# Altium project PCB_board.PrjPcb
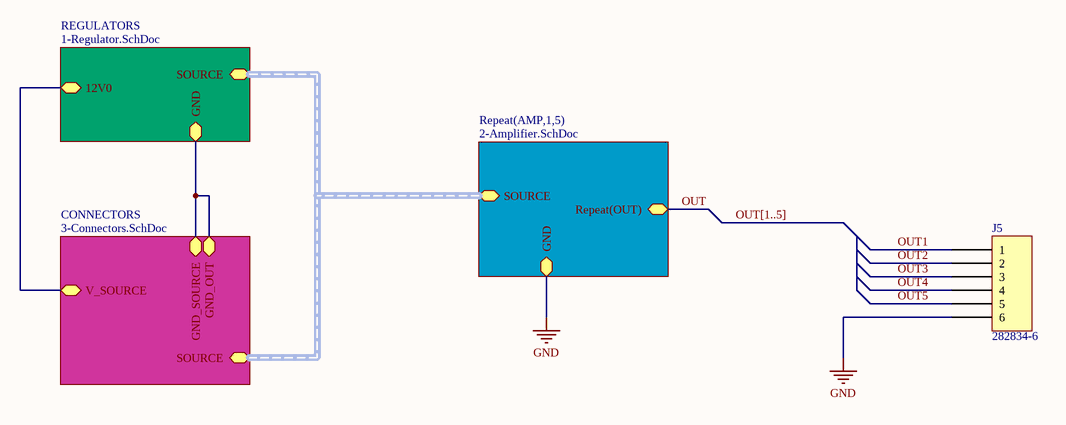
[diagram p0: 0-Hierarchy.SchDoc]
4 sheets, 54 parts. Net scope: hierarchical (ports join the sheet entries above them; power ports are global).
Board file: PCB_Class.PcbDoc
Sheets:
  0-Hierarchy.SchDoc
    REGULATORS = 1-Regulator.SchDoc
    CONNECTORS = 3-Connectors.SchDoc
    AMP1 = 2-Amplifier.SchDoc
    AMP2 = 2-Amplifier.SchDoc
    AMP3 = 2-Amplifier.SchDoc
    AMP4 = 2-Amplifier.SchDoc
    AMP5 = 2-Amplifier.SchDoc

## Sheet 0-Hierarchy.SchDoc
size A4; Author: Fabian Castaño; CompanyName: GIBIC Tech-Hub; Engineer: Fabian Castaño; Organization: Universidad de Antioquia; Address1: UdeA; Address2: Medellín; Address3: Antioquia; Address4: Colombia 050010; DocumentNumber: 1; SheetNumber: 1; SheetTotal: 4

### Parts
J5  282834-6  [TE 282834-6]

### Sub-sheets
CONNECTORS = 3-Connectors.SchDoc: V_SOURCE, GND_SOURCE, GND_OUT, SOURCE (harness SUP_HAR)
REGULATORS = 1-Regulator.SchDoc: 12V0, GND, SOURCE (harness SUP_HAR)
Repeat(AMP,1,5) = 2-Amplifier.SchDoc: SOURCE (harness SUP_HAR), Repeat(OUT), GND

### Nets
12V: sheet REGULATORS/12V0, sheet CONNECTORS/V_SOURCE
GND: J5.6 ; sheet REGULATORS/GND, sheet CONNECTORS/GND_SOURCE, sheet CONNECTORS/GND_OUT, sheet Repeat(AMP,1,5)/GND
OUT: sheet Repeat(AMP,1,5)/Repeat(OUT)
OUT1: J5.1
OUT2: J5.2
OUT3: J5.3
OUT4: J5.4
OUT5: J5.5

### Buses and harness runs
bus OUT[1..5]
harness sheet CONNECTORS/SOURCE = sheet REGULATORS/SOURCE = sheet Repeat(AMP,1,5)/SOURCE

### Notes on the sheet
- Notes
- Title
- Size:
- Date:
- A4
- Number:
- Time:
- Revision:
- Sheet
- of
- File:

### Library data of the parts
J5 = 282834-6: TERM BLK 6P SIDE ENT 2.54MM PCB; Manufacturer: TE Connectivity AMP Connectors; Current: 10A; Mating Orientation: Horizontal with Board; Number of Levels: 1; Pitch: 0.100" (2.54mm); Positions Per Level: 6; Voltage: 150V; Wire Gauge: 16-30 AWG; Wire Termination: Screw - Rising Cage Clamp; Part Number: 282834-6; Color: Green; ComponentLink1Description: Datasheet; ComponentLink1URL: https://www.te.com/commerce/DocumentDelivery/DDEController?Action=srchrtrv&DocNm=282834&DocType=Customer+Drawing&DocLang=English; ComponentLink2Description: DigiKey Link; ComponentLink2URL: http://digikey.com/product-detail/en/te-connectivity-amp-connectors/282834-6/A98337-ND/1153267; LastUpdated: 15/01/2020 04:16:31; Lifecycle Status: Active; Minimum Order: 1; Mounting Type: Through Hole; Packaging: Bulk; Part Status: Active; Price: 4.72; Series: Buchanan; Supplier 1: DigiKey; Supplier Part Number 1: A98337-ND

## Sheet 1-Regulator.SchDoc
size A4; Author: Fabian Castaño; CompanyName: GIBIC Tech-Hub; Engineer: Fabian Castaño; Organization: Universidad de Antioquia; Address1: UdeA; Address2: Medellín; Address3: Antioquia; Address4: Colombia 050010; DocumentNumber: 2; SheetNumber: 2; SheetTotal: 4
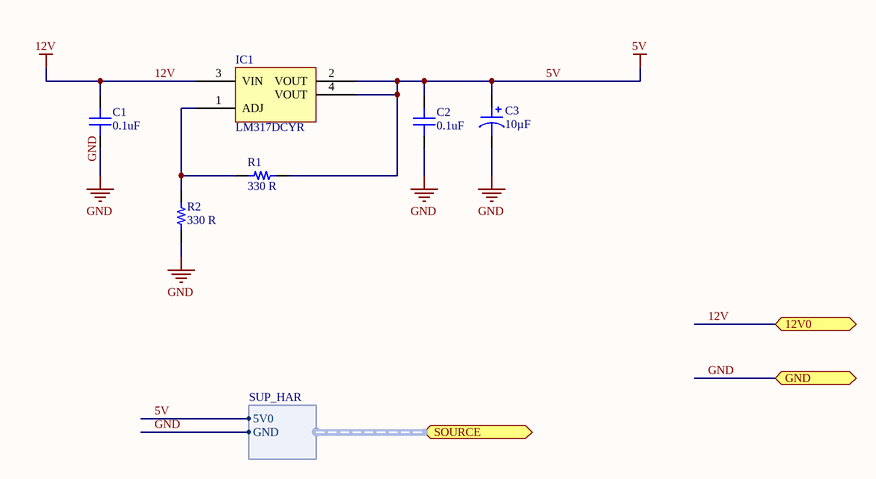
[diagram p1: 1-Regulator.SchDoc]

### Parts
C1  0.1uF  [CAP 0805_2012]
C2  0.1uF  [CAP 0805_2012]
C3  10µF  [CAP POL 1206_3216]
IC1  LM317DCYR  [TI SOT-223 DCY]
R1  330 R  [RES 0805_2012]
R2  330 R  [RES 0805_2012]

### Ports
12V0, GND, SOURCE (harness SUP_HAR)

### Harnesses
SUP_HAR: 5V0, GND

### Nets
5V: C2.2 C3.1 IC1.2(VOUT) IC1.4(VOUT) R1.2 ; port SOURCE.5V0
12V: C1.2 IC1.3(VIN) ; port 12V0
GND: C1.1 C2.1 C3.2 R2.1 ; port GND, port SOURCE.GND
NetIC1_1: IC1.1(ADJ) R1.1 R2.2

### Notes on the sheet
- Notes
- Title
- Size:
- Date:
- A4
- Number:
- Time:
- Revision:
- Sheet
- of
- File:

### Library data of the parts
C1 C2 = CBR08C569BCGAC: CAP CER 5.6PF 500V C0G/NP0 0805; Manufacturer: KEMET; Temperature Coefficient: C0G, NP0; Tolerance: ±0.1pF; Part Number: CBR08C569BCGAC; Value: 0.1uF; Applications: RF, Microwave, High Frequency; Capacitance: 5.6pF; ComponentLink1Description: Datasheet; ComponentLink1URL: https://api.kemet.com/component-edge/download/datasheet/CBR08C569BCGAC.pdf; ComponentLink2Description: DigiKey Link; ComponentLink2URL: http://digikey.com/product-detail/en/kemet/CBR08C569BCGAC/399-11260-1-ND/4376887; Device Package: 0805 (2012 Metric); Features: High Q, Low Loss, Ultra Low ESR; LastUpdated: 2/09/2020 01:04:42; Lifecycle Status: Active; Minimum Order: 1; Mounting Type: Surface Mount, MLCC; Operating Temperature: -55°C ~ 125°C; Package / Case: 0805 (2012 Metric); Packaging: TapeAndReel; PartId: 2427; Part Status: Active; Price: 0.48; Series: CBR-SMD RF C0G; Size / Dimension: 0.079" L x 0.049" W (2.00mm x 1.25mm); Supplier 1: DigiKey; Supplier Part Number 1: 399-11260-1-ND; Thickness (Max): 0.037" (0.95mm); Voltage - Rated: 500V
C3 = TR3A336K6R3C0600: CAP TANT 33UF 10% 6.3V 1206; Manufacturer: Vishay Sprague; Manufacturer Size Code: A; Capacitance: 33µF; ESR (Equivalent Series Resistance): 600mOhm; Type: Molded; Part Number: TR3A336K6R3C0600; Value: 10µF; ComponentLink1Description: Datasheet; ComponentLink1URL: http://www.vishay.com/docs/40080/tr3.pdf; ComponentLink2Description: DigiKey Link; ComponentLink2URL: http://digikey.com/product-detail/en/vishay-sprague/TR3A336K6R3C0600/718-1305-1-ND/1663027; Device Package: 1206 (3216 Metric); Features: General Purpose; Height - Seated (Max): 0.071" (1.80mm); LastUpdated: 2/09/2020 01:15:58; Lifecycle Status: Active; Minimum Order: 1; Mounting Type: Surface Mount; Operating Temperature: -55°C ~ 125°C; Package / Case: 1206 (3216 Metric); Packaging: TapeAndReel; PartId: 297; Part Status: Active; Price: 0.24; Series: TANTAMOUNT®, TR3; Size / Dimension: 0.126" L x 0.063" W (3.20mm x 1.60mm); Supplier 1: DigiKey; Supplier Part Number 1: 718-1305-1-ND; Tolerance: ±10%; Voltage - Rated: 6.3V
IC1 = LM317DCYR: IC REG LIN POS ADJ 1.5A SOT223-4; Manufacturer: Texas Instruments; Number of Regulators: 1; Output Configuration: Positive; Output Type: Adjustable; Protection Features: Over Temperature, Short Circuit; PSRR: 64dB ~ 57dB (120Hz); Voltage - Input (Max): 40V; Voltage - Output (Max): 37V; Voltage - Output (Min/Fixed): 1.25V; Part Number: LM317DCYR; ComponentLink1Description: Datasheet; ComponentLink1URL: http://www.ti.com/general/docs/suppproductinfo.tsp?distId=10&gotoUrl=http%3A%2F%2Fwww.ti.com%2Flit%2Fgpn%2Flm317; ComponentLink2Description: DigiKey Link; ComponentLink2URL: //digikey.com/product-detail/en/texas-instruments/LM317DCYR/296-12602-2-ND/443739; Current - Output: 1.5A; Device Package: TO-261-4, TO-261AA; LastUpdated: 9/12/2019 14:53:08; Lifecycle Status: 0; Minimum Order: 1; Mounting Type: Surface Mount; Operating Temperature: 0°C ~ 125°C; Package / Case: TO-261-4, TO-261AA; Packaging: TapeAndReel; Part Status: Active; Price: 0.28; Series: -; Supplier 1: DigiKey; Supplier Part Number 1: 296-12602-2-ND; Supplier Device Package: SOT-223-4
R1 R2 = RNCF0805DTE82K0: RES 82K OHM 0.5% 1/8W 0805; Manufacturer: Stackpole Electronics Inc; Power (Watts): 0.125W, 1/8W; Resistance: 82 kOhms; Temperature Coefficient: ±25ppm/°C; Part Number: RNCF0805DTE82K0; Value: 330 R; ComponentLink1Description: Datasheet; ComponentLink1URL: https://www.seielect.com/catalog/sei-rncf.pdf; ComponentLink2Description: DigiKey Link; ComponentLink2URL: http://digikey.com/product-detail/en/stackpole-electronics-inc/RNCF0805DTE82K0/RNCF0805DTE82K0CT-ND/9915472; Composition: Thin Film; Device Package: 0805 (2012 Metric); Features: Automotive AEC-Q200; Height - Seated (Max): 0.026" (0.65mm); LastUpdated: 2/09/2020 01:15:08; Lifecycle Status: Active; Minimum Order: 1; Number of Terminations: 2; Operating Temperature: -55°C ~ 155°C; Package / Case: 0805 (2012 Metric); Packaging: TapeAndReel; PartId: 35165; Part Status: Active; Price: 0.02; Ratings: AEC-Q200; Series: RNCF; Size / Dimension: 0.079" L x 0.049" W (2.00mm x 1.25mm); Supplier 1: DigiKey; Supplier Part Number 1: RNCF0805DTE82K0CT-ND; Supplier Device Package: 0805; Tolerance: ±0.5%

## Sheet 3-Connectors.SchDoc
size A4; Author: Fabian Castaño; CompanyName: GIBIC Tech-Hub; Engineer: Fabian Castaño; Organization: Universidad de Antioquia; Address1: UdeA; Address2: Medellín; Address3: Antioquia; Address4: Colombia 050010; DocumentNumber: 4; SheetNumber: 4; SheetTotal: 4
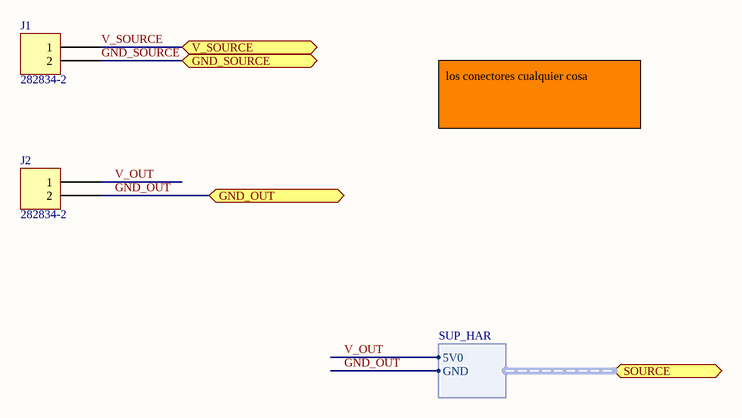
[diagram p2: 3-Connectors.SchDoc]

### Parts
J1  282834-2  [TE 282834-2]
J2  282834-2  [TE 282834-2]

### Ports
GND_OUT, GND_SOURCE, SOURCE (harness SUP_HAR), V_SOURCE

### Harnesses
SUP_HAR: 5V0, GND

### Nets
GND_OUT: J1.2 J2.2 ; port GND_SOURCE, port GND_OUT, port SOURCE.GND  [also labelled GND_SOURCE]  [project net GND]
V_OUT: J2.1 ; port SOURCE.5V0  [project net 5V]
V_SOURCE: J1.1 ; port V_SOURCE  [project net 12V]

### Notes on the sheet
- los conectores cualquier cosa
- Notes
- Title
- Size:
- Date:
- A4
- Number:
- Time:
- Revision:
- Sheet
- of
- File:

### Library data of the parts
J1 J2 = 282834-2: TERM BLK 2P SIDE ENT 2.54MM PCB; Manufacturer: TE Connectivity AMP Connectors; Current: 10A; Mating Orientation: Horizontal with Board; Number of Levels: 1; Pitch: 0.100" (2.54mm); Positions Per Level: 2; Voltage: 150V; Wire Gauge: 16-30 AWG; Wire Termination: Screw - Rising Cage Clamp; Part Number: 282834-2; Color: Green; ComponentLink1Description: Datasheet; ComponentLink1URL: https://www.te.com/commerce/DocumentDelivery/DDEController?Action=srchrtrv&DocNm=282834&DocType=Customer+Drawing&DocLang=English; ComponentLink2Description: DigiKey Link; ComponentLink2URL: http://digikey.com/product-detail/en/te-connectivity-amp-connectors/282834-2/A98333-ND/1150135; LastUpdated: 15/01/2020 04:15:38; Lifecycle Status: Active; Minimum Order: 1; Mounting Type: Through Hole; Packaging: Bulk; Part Status: Active; Price: 0.88; Series: Buchanan; Supplier 1: DigiKey; Supplier Part Number 1: A98333-ND

## Sheet 2-Amplifier.SchDoc
size A4; Author: Fabian Castaño; CompanyName: GIBIC Tech-Hub; Engineer: Fabian Castaño; Organization: Universidad de Antioquia; Address1: UdeA; Address2: Medellín; Address3: Antioquia; Address4: Colombia 050010; DocumentNumber: 3; SheetNumber: 3; SheetTotal: 4
Used 5 times, as channels AMP1, AMP2, AMP3, AMP4, AMP5. Parts and nets are listed once, with the designators drawn on the sheet.
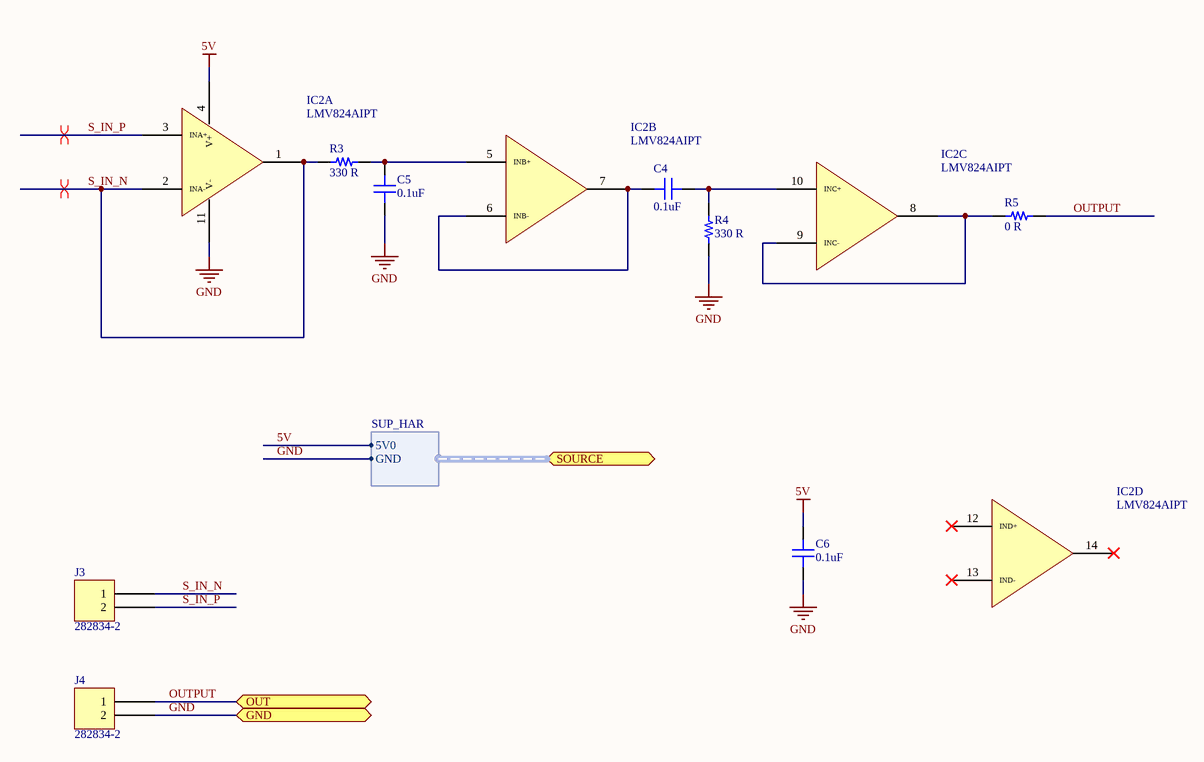
[diagram p3: 2-Amplifier.SchDoc]

### Parts
C4  0.1uF  [CAP 0805_2012]
C5  0.1uF  [CAP 0805_2012]
C6  0.1uF  [CAP 0805_2012]
IC2  LMV824AIPT  [TI TSSOP-14 PW]  (parts A,B,C,D of 4)
J3  282834-2  [TE 282834-2]
J4  282834-2  [TE 282834-2]
R3  330 R  [RES 0805_2012]
R4  330 R  [RES 0805_2012]
R5  0 R  [RES 0805_2012]

### Ports
GND, OUT, SOURCE (harness SUP_HAR)

### Harnesses
SUP_HAR: 5V0, GND

### Nets
5V: C6.2 IC2.4(V+) ; port SOURCE.5V0
GND: C5.1 C6.1 IC2.11(V-) J4.2 R4.1 ; port GND, port SOURCE.GND
OUTPUT: J4.1 R5.1 ; port OUT
S_IN_N: IC2.1(OUT) IC2.2(INA-) J3.1 R3.1
S_IN_P: IC2.3(INA+) J3.2
NetC4_1: C4.1 IC2.10(INC+) R4.2
NetC4_2: C4.2 IC2.6(INB-) IC2.7(OUTB)
NetC5_2: C5.2 IC2.5(INB+) R3.2
NetIC2_8: IC2.8(OUTC) IC2.9(INC-) R5.2

Not connected (* = marked no-connect by the designer): IC2 12(IND+)* 13(IND-)* 14(OUTD)*

### Channels
AMP1: designators end in _AMP1; ports GND=GND OUT=OUT1
AMP2: designators end in _AMP2; ports GND=GND OUT=OUT2
AMP3: designators end in _AMP3; ports GND=GND OUT=OUT3
AMP4: designators end in _AMP4; ports GND=GND OUT=OUT4
AMP5: designators end in _AMP5; ports GND=GND OUT=OUT5

### Layout directives
differential pair: S_IN_N_AMP1, S_IN_P_AMP1

### Notes on the sheet
- Notes
- Title
- Size:
- Date:
- A4
- Number:
- Time:
- Revision:
- Sheet
- of
- File:

### Library data of the parts
C4-C6 = CBR08C569BCGAC: as C1 on sheet 1-Regulator; Part Number: CBR08C569BCGAC; Value: 0.1uF; Applications: RF, Microwave, High Frequency; Capacitance: 5.6pF; ComponentLink1Description: Datasheet; ComponentLink1URL: https://api.kemet.com/component-edge/download/datasheet/CBR08C569BCGAC.pdf; ComponentLink2Description: DigiKey Link; ComponentLink2URL: http://digikey.com/product-detail/en/kemet/CBR08C569BCGAC/399-11260-1-ND/4376887; Device Package: 0805 (2012 Metric); Features: High Q, Low Loss, Ultra Low ESR; LastUpdated: 2/09/2020 01:04:42; Lifecycle Status: Active; Minimum Order: 1; Mounting Type: Surface Mount, MLCC; Operating Temperature: -55°C ~ 125°C; Package / Case: 0805 (2012 Metric); Packaging: TapeAndReel; PartId: 2427; Part Status: Active; Price: 0.48; Series: CBR-SMD RF C0G; Size / Dimension: 0.079" L x 0.049" W (2.00mm x 1.25mm); Supplier 1: DigiKey; Supplier Part Number 1: 399-11260-1-ND; Thickness (Max): 0.037" (0.95mm); Voltage - Rated: 500V
IC2 = LMV824AIPT: IC OPAMP GP 4 CIRCUIT 14TSSOP; Manufacturer: STMicroelectronics; Amplifier Type: General Purpose; Current - Input Bias: 60nA; Current - Output / Channel: 70mA; Current - Supply: 300µA; Gain Bandwidth Product: 5.5MHz; Number of Circuits: 4; Output Type: Rail-to-Rail; Slew Rate: 1.9V/µs; Voltage - Input Offset: 800µV; Voltage - Supply, Single/Dual (±): 2.5V ~ 5.5V; Part Number: LMV824AIPT; ComponentLink1Description: Datasheet; ComponentLink1URL: http://www.st.com/content/ccc/resource/technical/document/datasheet/39/12/97/14/01/a7/4f/de/DM00041851.pdf/files/DM00041851.pdf/jcr:content/translations/en.DM00041851.pdf; ComponentLink2Description: DigiKey Link; ComponentLink2URL: http://digikey.com/product-detail/en/stmicroelectronics/LMV824AIPT/497-12825-1-ND/3028576; Device Package: 14-TSSOP (0.173", 4.40mm Width); LastUpdated: 9/01/2020 02:13:49; Lifecycle Status: Active; Minimum Order: 1; Mounting Type: Surface Mount; Operating Temperature: -40°C ~ 125°C; Package / Case: 14-TSSOP (0.173", 4.40mm Width); Packaging: ReReel; PartId: 21; Part Status: Active; Price: 0.00; Series: -; Supplier 1: DigiKey; Supplier Part Number 1: 497-12825-1-ND; Supplier Device Package: 14-TSSOP
J3 J4 = 282834-2: as J1 on sheet 3-Connectors; Part Number: 282834-2; Color: Green; ComponentLink1Description: Datasheet; ComponentLink1URL: https://www.te.com/commerce/DocumentDelivery/DDEController?Action=srchrtrv&DocNm=282834&DocType=Customer+Drawing&DocLang=English; ComponentLink2Description: DigiKey Link; ComponentLink2URL: http://digikey.com/product-detail/en/te-connectivity-amp-connectors/282834-2/A98333-ND/1150135; LastUpdated: 15/01/2020 04:15:38; Lifecycle Status: Active; Minimum Order: 1; Mounting Type: Through Hole; Packaging: Bulk; Part Status: Active; Price: 0.88; Series: Buchanan; Supplier 1: DigiKey; Supplier Part Number 1: A98333-ND
R3-R5 = RNCF0805DTE82K0: as R1 on sheet 1-Regulator; Part Number: RNCF0805DTE82K0; ComponentLink1Description: Datasheet; ComponentLink1URL: https://www.seielect.com/catalog/sei-rncf.pdf; ComponentLink2Description: DigiKey Link; ComponentLink2URL: http://digikey.com/product-detail/en/stackpole-electronics-inc/RNCF0805DTE82K0/RNCF0805DTE82K0CT-ND/9915472; Composition: Thin Film; Device Package: 0805 (2012 Metric); Features: Automotive AEC-Q200; Height - Seated (Max): 0.026" (0.65mm); LastUpdated: 2/09/2020 01:15:08; Lifecycle Status: Active; Minimum Order: 1; Number of Terminations: 2; Operating Temperature: -55°C ~ 155°C; Package / Case: 0805 (2012 Metric); Packaging: TapeAndReel; PartId: 35165; Part Status: Active; Price: 0.02; Ratings: AEC-Q200; Series: RNCF; Size / Dimension: 0.079" L x 0.049" W (2.00mm x 1.25mm); Supplier 1: DigiKey; Supplier Part Number 1: RNCF0805DTE82K0CT-ND; Supplier Device Package: 0805; Tolerance: ±0.5%
  R3 R4: Value: 330 R
  R5: Value: 0 R

## Nets that join several sheets
5V: 1-Regulator (5 pins), 3-Connectors (J2.1), AMP1 (C6_AMP1.2 IC2_AMP1.4), AMP2 (C6_AMP2.2 IC2_AMP2.4), AMP3 (C6_AMP3.2 IC2_AMP3.4), AMP4 (C6_AMP4.2 IC2_AMP4.4), AMP5 (C6_AMP5.2 IC2_AMP5.4)
12V: 1-Regulator (C1.2 IC1.3), 3-Connectors (J1.1)
GND: 0-Hierarchy (J5.6), 1-Regulator (C1.1 C2.1 C3.2 R2.1), 3-Connectors (J1.2 J2.2), AMP1 (5 pins), AMP2 (5 pins), AMP3 (5 pins), AMP4 (5 pins), AMP5 (5 pins)
OUT1: 0-Hierarchy (J5.1), AMP1 (J4_AMP1.1 R5_AMP1.1)
OUT2: 0-Hierarchy (J5.2), AMP2 (J4_AMP2.1 R5_AMP2.1)
OUT3: 0-Hierarchy (J5.3), AMP3 (J4_AMP3.1 R5_AMP3.1)
OUT4: 0-Hierarchy (J5.4), AMP4 (J4_AMP4.1 R5_AMP4.1)
OUT5: 0-Hierarchy (J5.5), AMP5 (J4_AMP5.1 R5_AMP5.1)